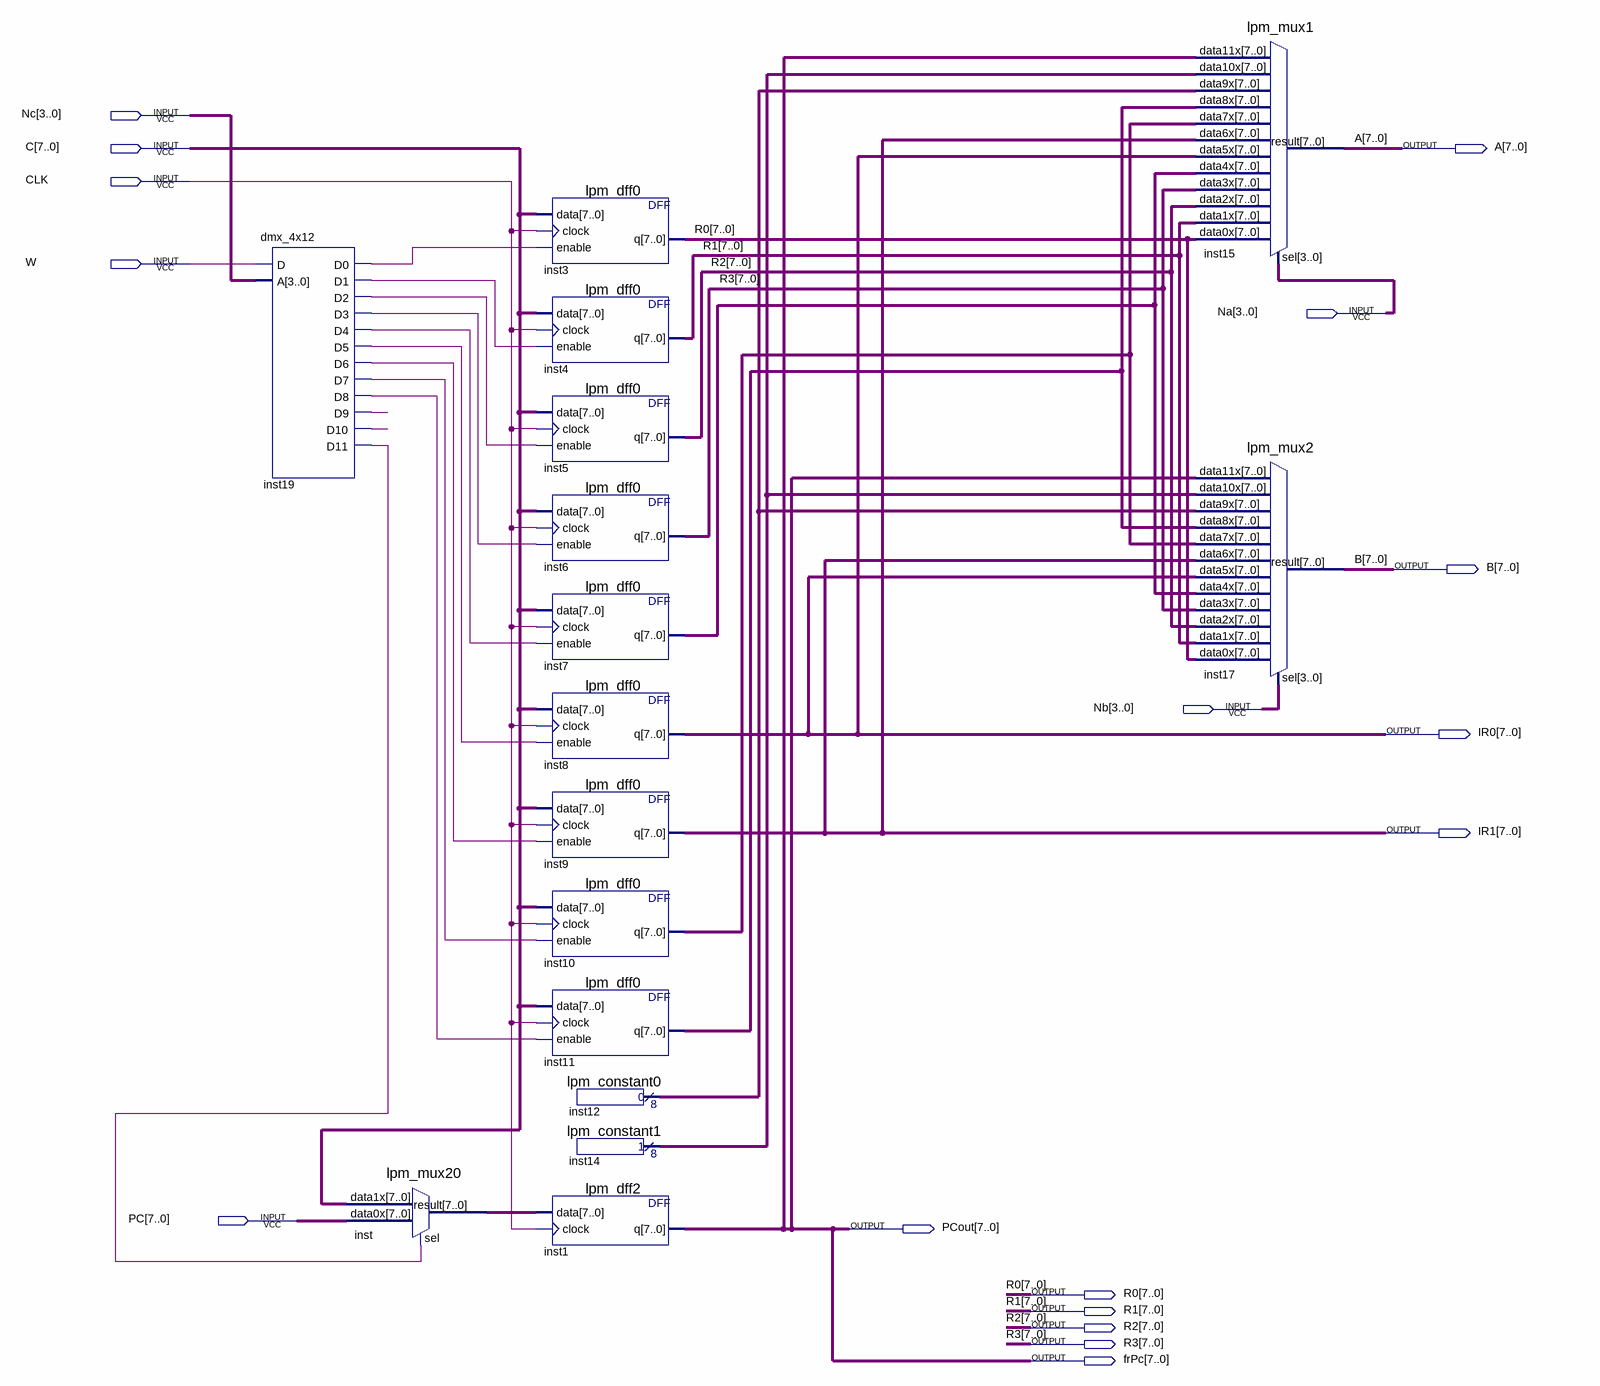
[diagram p0: schematic sheet]
// Quartus schematic GPR.bdf as structural Verilog: 16 symbols, 17 pins
module GPR (
  input  [3:0] Nc,
  input  [7:0] C,
  input  CLK,
  input  W,
  input  [3:0] Na,
  input  [3:0] Nb,
  input  [7:0] PC,
  output [7:0] A,
  output [7:0] B,
  output [7:0] IR0,
  output [7:0] IR1,
  output [7:0] PCout,
  output [7:0] R0,
  output [7:0] R1,
  output [7:0] R2,
  output [7:0] R3,
  output [7:0] frPc
);

  wire inst19_d0, inst19_d1, inst19_d2, inst19_d3, inst19_d4, inst19_d5, inst19_d6, inst19_d7, inst19_d8,
       inst19_d9, inst19_d10, inst19_d11;
  wire [7:0] inst7_q, inst10_q, inst11_q, inst12_result, inst14_result, inst_result;

  dmx_4x12 inst19 (
    .D(W), .A(Nc), .D0(inst19_d0), .D1(inst19_d1), .D2(inst19_d2), .D3(inst19_d3), .D4(inst19_d4),
    .D5(inst19_d5), .D6(inst19_d6), .D7(inst19_d7), .D8(inst19_d8), .D9(inst19_d9), .D10(inst19_d10),
    .D11(inst19_d11));
  lpm_mux20 inst (.data1x(C), .data0x(PC), .sel(inst19_d11), .result(inst_result));
  lpm_dff0 inst3 (.data(C), .clock(CLK), .enable(inst19_d0), .q(R0));
  lpm_dff0 inst4 (.data(C), .clock(CLK), .enable(inst19_d1), .q(R1));
  lpm_dff0 inst5 (.data(C), .clock(CLK), .enable(inst19_d2), .q(R2));
  lpm_dff0 inst6 (.data(C), .clock(CLK), .enable(inst19_d3), .q(R3));
  lpm_dff0 inst7 (.data(C), .clock(CLK), .enable(inst19_d4), .q(inst7_q));
  lpm_dff0 inst8 (.data(C), .clock(CLK), .enable(inst19_d5), .q(IR0));
  lpm_dff0 inst9 (.data(C), .clock(CLK), .enable(inst19_d6), .q(IR1));
  lpm_dff0 inst10 (.data(C), .clock(CLK), .enable(inst19_d7), .q(inst10_q));
  lpm_dff0 inst11 (.data(C), .clock(CLK), .enable(inst19_d8), .q(inst11_q));
  lpm_dff2 inst1 (.data(inst_result), .clock(CLK), .q(frPc));
  lpm_constant0 inst12 (.result(inst12_result));
  lpm_constant1 inst14 (.result(inst14_result));
  lpm_mux1 inst15 (
    .data11x(frPc), .data10x(inst14_result), .data9x(inst12_result), .data8x(inst11_q), .data7x(inst10_q),
    .data6x(IR1), .data5x(IR0), .data4x(inst7_q), .data3x(R3), .data2x(R2), .data1x(R1), .data0x(R0),
    .sel(Na), .result(A));
  lpm_mux2 inst17 (
    .data11x(frPc), .data10x(inst14_result), .data9x(inst12_result), .data8x(inst11_q), .data7x(inst10_q),
    .data6x(IR1), .data5x(IR0), .data4x(inst7_q), .data3x(R3), .data2x(R2), .data1x(R1), .data0x(R0),
    .sel(Nb), .result(B));

  assign PCout = frPc;
endmodule
